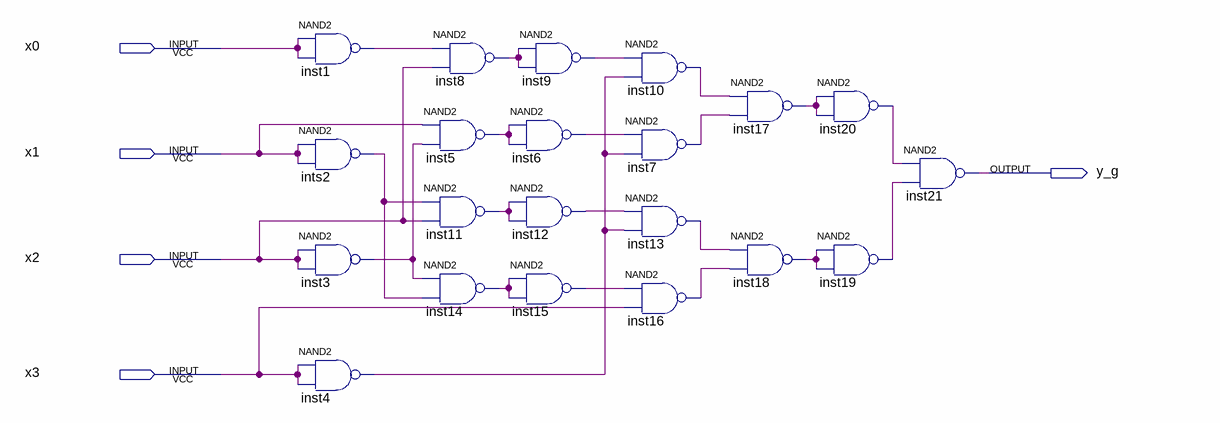
[diagram p0: schematic sheet]
// Quartus schematic y_g.bdf as structural Verilog: 21 symbols, 5 pins
module y_g (
  input  x0,
  input  x1,
  input  x2,
  input  x3,
  output y_g
);

  wire inst1_out, inst3_out, inst4_out, inst5_out, inst6_out, inst7_out, inst8_out, inst9_out, inst10_out,
       inst11_out, inst12_out, inst13_out, inst14_out, inst15_out, inst16_out, inst17_out, inst18_out,
       inst19_out, inst20_out, ints2_out;

  nand inst1 (inst1_out, x0, x0);
  nand ints2 (ints2_out, x1, x1);
  nand inst3 (inst3_out, x2, x2);
  nand inst4 (inst4_out, x3, x3);
  nand inst8 (inst8_out, inst1_out, x2);
  nand inst5 (inst5_out, x1, inst3_out);
  nand inst11 (inst11_out, ints2_out, x2);
  nand inst14 (inst14_out, inst3_out, ints2_out);
  nand inst9 (inst9_out, inst8_out, inst8_out);
  nand inst6 (inst6_out, inst5_out, inst5_out);
  nand inst12 (inst12_out, inst11_out, inst11_out);
  nand inst15 (inst15_out, inst14_out, inst14_out);
  nand inst10 (inst10_out, inst9_out, inst4_out);
  nand inst7 (inst7_out, inst6_out, inst4_out);
  nand inst13 (inst13_out, inst12_out, inst4_out);
  nand inst16 (inst16_out, inst15_out, x3);
  nand inst17 (inst17_out, inst10_out, inst7_out);
  nand inst18 (inst18_out, inst13_out, inst16_out);
  nand inst20 (inst20_out, inst17_out, inst17_out);
  nand inst19 (inst19_out, inst18_out, inst18_out);
  nand inst21 (y_g, inst20_out, inst19_out);
endmodule
